# EAGLE design Review_PCD_1.8 (EAGLE 9.6.2)
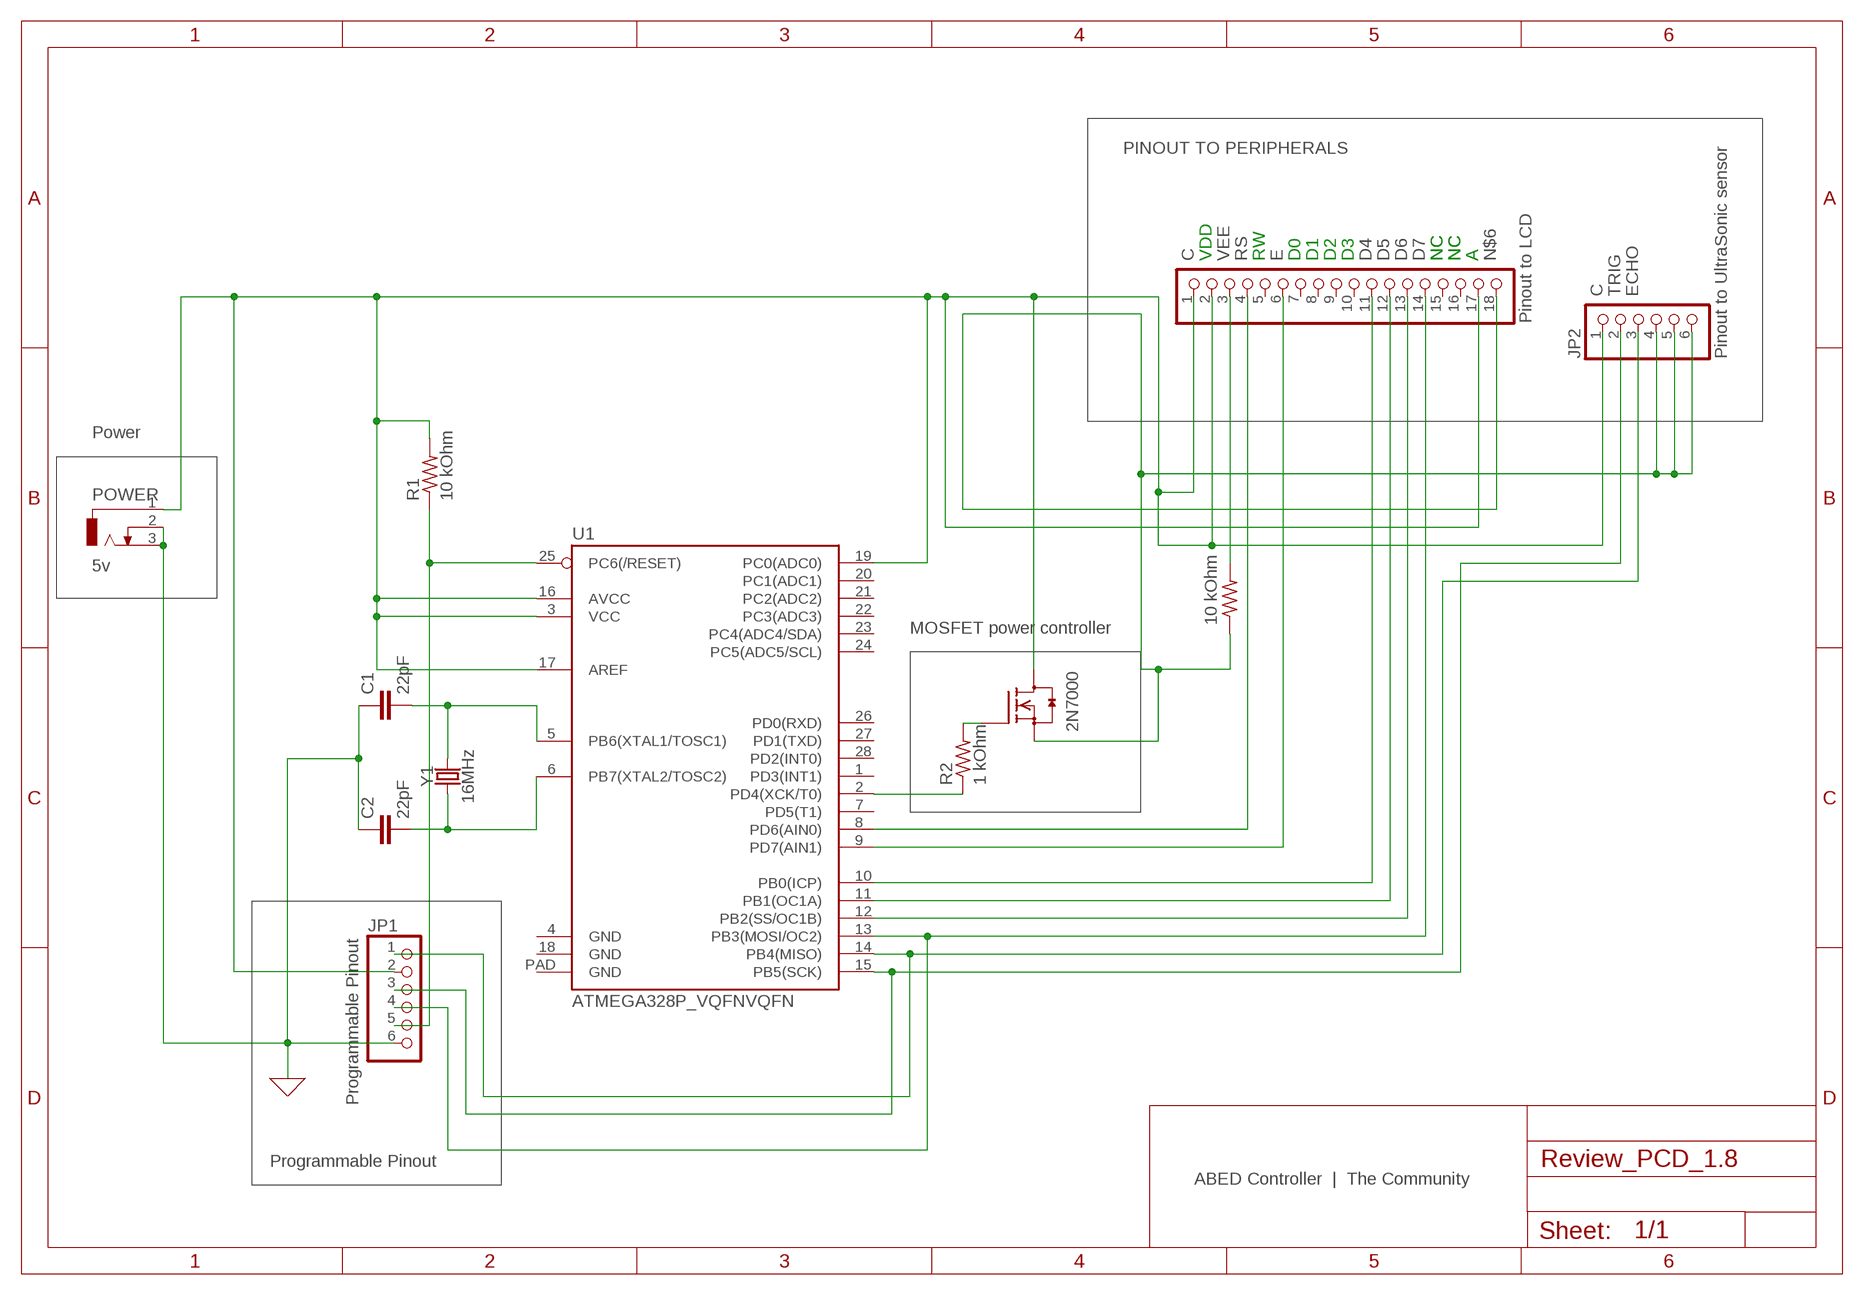
[diagram p0: schematic, sheet 1]

## Parts
C1  22pF  22PF-PTH-2.54MM-200V-5%  [CAP-PTH-2.54]
C2  22pF  22PF-PTH-2.54MM-200V-5%  [CAP-PTH-2.54]
JP1  Programmable Pinout  PINHD-1X6-3.5MM  [1X06-3.5MM]
JP2  Pinout to UltraSonic sensor  PINHD-1X6B  [1X06-BIG]
JP3  Pinout to LCD  PINHD-1X18  [1X18]
POWER  5v  DCJ0202  [DCJ0202]
Q2  2N7000  2N7000KL/BS170KL  [TO92]
R1  10 kOhm  R-US_R2012W  [R2012W]
R2  1 kOhm  R-US_R2012W  [R2012W]
R3  10 kOhm  R-US_R2012W  [R2012W]
U1  ATMEGA328P_VQFNVQFN  [VQFN-28]
Y1  16MHz  CRYSTAL-16MHZPTH-HC49US  [HC49US]

## Nets
0: C1.1 C2.1 JP1.6 POWER.2 POWER.3 ; supply symbol labelled GND
C: JP1.2 JP2.1 JP3.1 JP3.2 JP3.17 POWER.1 Q2.3(D) R1.2 U1.3(VCC) U1.16(AVCC) U1.17(AREF) U1.19(PC0(ADC0))
D4: JP3.11 U1.10(PB0(ICP))
D5: JP3.12 U1.11(PB1(OC1A))
D6: JP3.13 U1.12(PB2(SS/OC1B))
D7: JP1.4 JP3.14 U1.13(PB3(MOSI/OC2))
E: JP3.6 U1.9(PD7(AIN1))
ECHO: JP1.1 JP2.3 U1.14(PB4(MISO))
N$1: Q2.2(G) R2.2
N$2: JP1.5 R1.1 U1.25(PC6(/RESET))
N$3: R2.1 U1.2(PD4(XCK/T0))
N$4: C1.2 U1.5(PB6(XTAL1/TOSC1)) Y1.2
N$5: C2.2 U1.6(PB7(XTAL2/TOSC2)) Y1.1
N$6: JP2.4 JP2.5 JP2.6 JP3.18 Q2.1(S) R3.1
RS: JP3.4 U1.8(PD6(AIN0))
TRIG: JP1.3 JP2.2 U1.15(PB5(SCK))
VEE: JP3.3 R3.2
Unconnected: JP3.5 JP3.7 JP3.8 JP3.9 JP3.10 JP3.15 JP3.16 U1.1(PD3(INT1)) U1.4(GND) U1.7(PD5(T1)) U1.18(GND) U1.20(PC1(ADC1)) U1.21(PC2(ADC2)) U1.22(PC3(ADC3)) U1.23(PC4(ADC4/SDA)) U1.24(PC5(ADC5/SCL)) U1.26(PD0(RXD)) U1.27(PD1(TXD)) U1.28(PD2(INT0)) U1.PAD(GND)

## Notes on the sheet
- PINOUT TO PERIPHERALS
- VDD | RW | D0 | D1 | D2 | D3 | NC | NC | NC | NC | A
- Power
- MOSFET power controller
- Programmable Pinout
- ABED Controller  |  The Community

## Library data of the parts
C1 C2 = SparkFun-Capacitors:22PF: 22pF ceramic capacitors A capacitor is a passive two-terminal electrical component used to store electrical energy temporarily in an electric field.; PROD_ID: CAP-09128
JP1 JP2 = adafruit:PINHD-1X6: PIN HEADER
JP3 = adafruit:PINHD-1X18: PIN HEADER
POWER = con-jack:DCJ0202: DC POWER JACK Source: DCJ0202.pdf; OC_FARNELL: unknown; OC_NEWARK: unknown
Q2 = m-pad-2.1:2N7000KL/BS170KL: Vishay Siliconix 2N7000KL/BS170KL N-Channel 60-V (D-S) MOSFET FEATURES: TrenchFET Power MOSFET ESD Protected: 2000 V APPLICATIONS: Direct Logic-Level Interface: TTL/CMOS Soild State Relays Drivers: Relays, Solenoids, Lamps, Hammers, Displays, Memories, Transistors, etc. Battery Operated Systems Please send any comments to: messi@users.sourceforge.net
R1 = adafruit:R-US_: RESISTOR, American symbol
R2 = adafruit:R-US_: RESISTOR, American symbol; R1: 1 kOhm
R3 = adafruit:R-US_: RESISTOR, American symbol; R1: 10 kOhm
U1 = SparkFun-IC-Microcontroller:ATMEGA328P_VQFN: Atmel 328P QFN part not in catalog
Y1 = SparkFun-Clocks:CRYSTAL-16MHZ: 16MHz Crystal Digikey Example <http://www.digikey.com/product-search/en?keywords=535-9122-1-ND> Frequency: 16MHz Frequency Stability: ±50ppm Frequency Tolerance: ±20ppm Load Capacitance: 18pF SparkFun Products: Pro Micro -5V/16MHz <https://www.sparkfun.com/products/12640> SparkFun Serial Enabled LCD Kit <https://www.sparkfun.com/products/10097>; PROD_ID: XTAL-08181; SF_ID: COM-00536

## Board
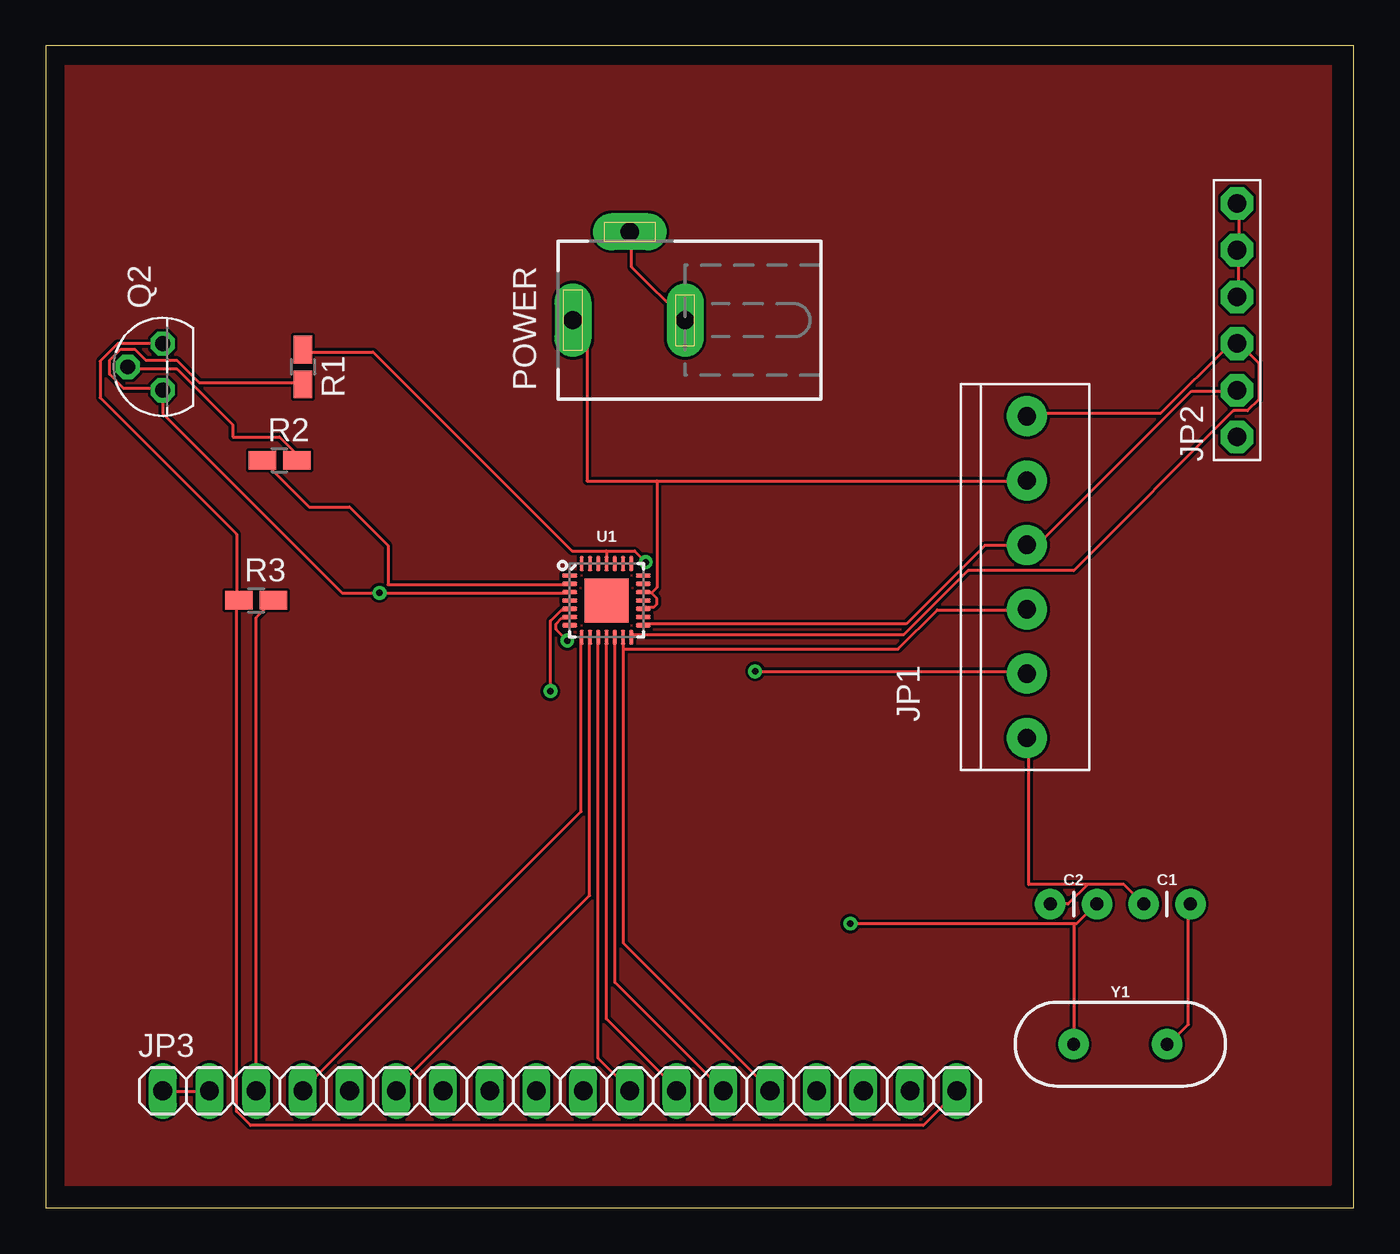
[diagram p1: board, top side]
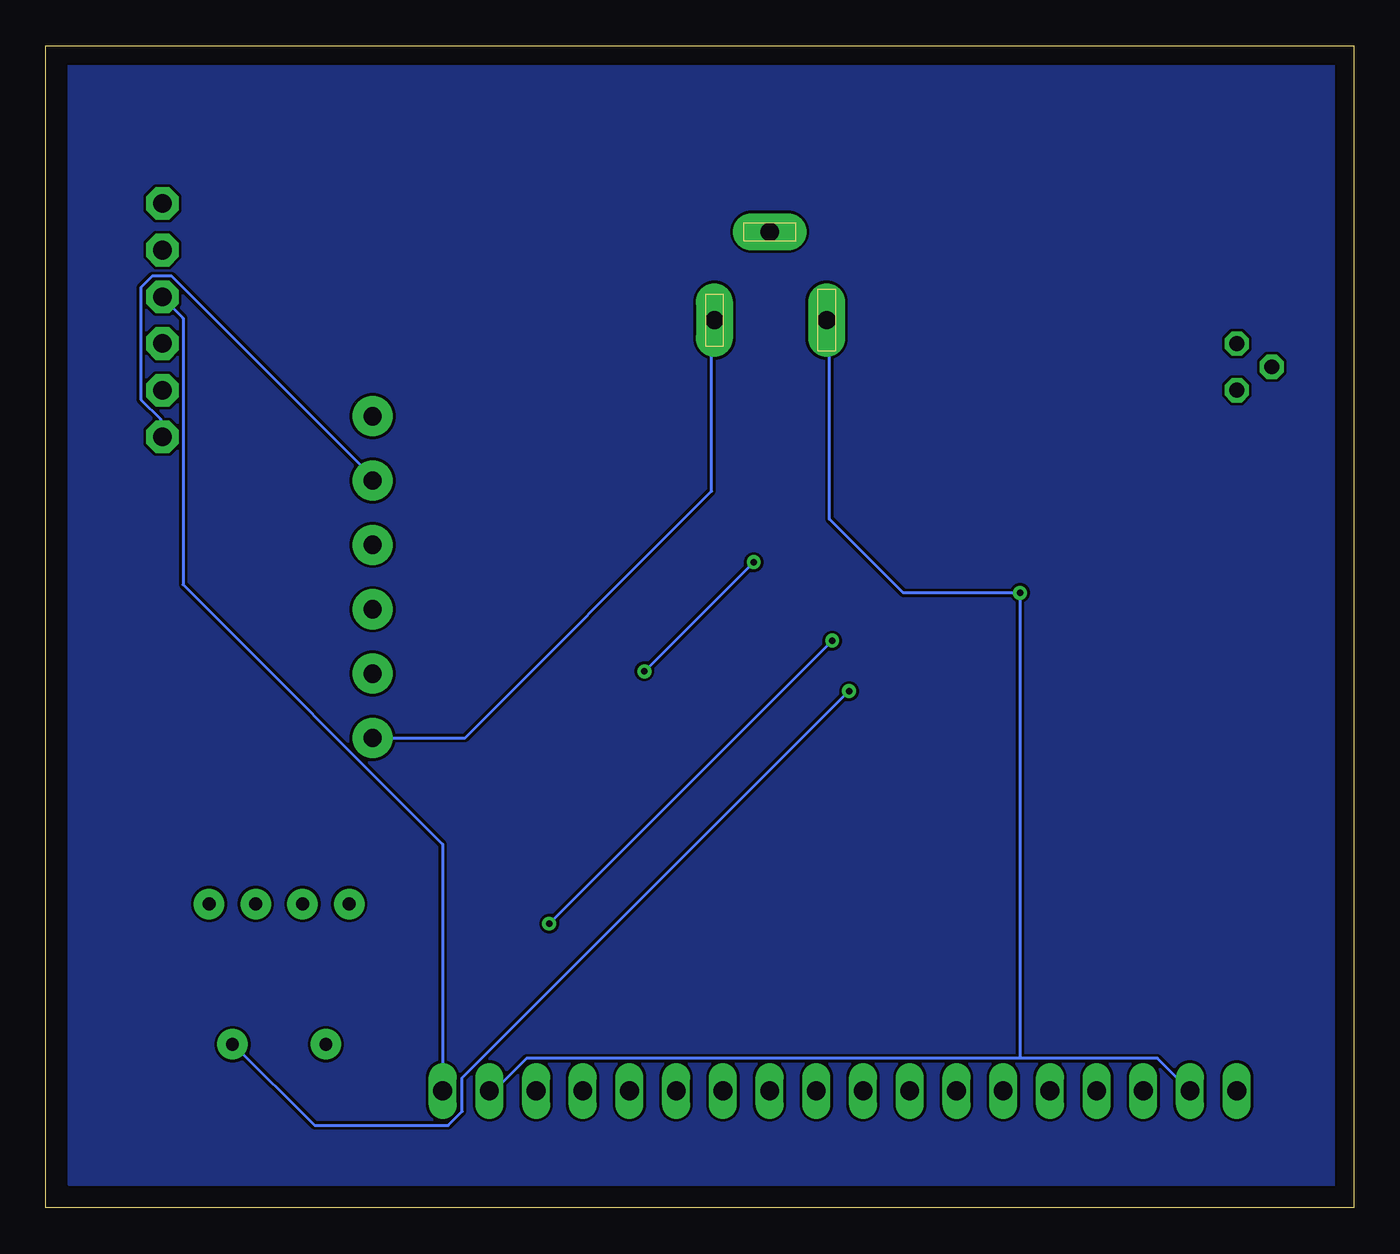
[diagram p2: board, bottom side, seen from below]

Size 71.1 x 63.17 mm. Coordinates in mm from the lower left corner, seen from the top.
Outline: 0,0 71.1,0 71.1,63.17 0,63.17 0,0
Copper layers (1*16): Top 0.035mm / dielectric 0.15mm / Bottom 0.035mm
Design rules "default": minimum track width 6mil, minimum drill 0.35mm, track to track 6mil, track to pad 6mil, pad to pad 6mil, via to via 6mil, smd to smd 6mil, copper to edge 40mil, drill to drill 6mil, minimum pad ring 10mil, minimum via ring 8mil, stop-mask expansion 4mil, vias tented up to drill 0mil, thermal gap 10mil

### Footprints (pad centres in the part's own frame; a part is rotated, then mirrored left to right if it is on the bottom)
CAP-PTH-2.54 = drill 0.7 pad 1.651: 1 -1.27,0; 2 1.27,0
1X06-3.5MM = drill 1 pad 2.184: 1 -8.75,0; 2 -5.25,0; 3 -1.75,0; 4 1.75,0; 5 5.25,0; 6 8.75,0
1X06-BIG = drill 1.016 pad 1.778 octagon: 1 -6.35,0; 2 -3.81,0; 3 -1.27,0; 4 1.27,0; 5 3.81,0; 6 6.35,0
1X18 = drill 1.016 long: 1 -21.59,0; 2 -19.05,0; 3 -16.51,0; 4 -13.97,0; 5 -11.43,0; 6 -8.89,0; 7 -6.35,0; 8 -3.81,0; 9 -1.27,0; 10 1.27,0; 11 3.81,0; 12 6.35,0; 13 8.89,0; 14 11.43,0; 15 13.97,0; 16 16.51,0; 17 19.05,0; 18 21.59,0
DCJ0202 = drill 1 pad 2 long: 1 0,3.1; 2 4.8,0; 3 0,-3
TO92 = drill 0.813 octagon: 1 1.27,0; 2 0,1.905; 3 -1.27,0
R2012W = smd 1.5 x 1: 1 -0.94,0; 2 0.94,0
VQFN-28 = smd 0.82 x 0.24: 1 -2,1.35; 2 -2,0.9; 3 -2,0.45; 4 -2,0; 5 -2,-0.45; 6 -2,-0.9; 7 -2,-1.35; 15 2,-1.35; 16 2,-0.9; 17 2,-0.45; 18 2,0; 19 2,0.45; 20 2,0.9; 21 2,1.35 | smd 0.24 x 0.82: 8 -1.35,-2; 9 -0.9,-2; 10 -0.45,-2; 11 0,-2; 12 0.45,-2; 13 0.9,-2; 14 1.35,-2; 22 1.35,2; 23 0.9,2; 24 0.45,2; 25 0,2; 26 -0.45,2; 27 -0.9,2; 28 -1.35,2 | smd 2.4 x 2.4: PAD 0,0
HC49US = drill 0.7 pad 1.651: 1 -2.54,0; 2 2.54,0

### Placement (x,y rotation side)
C1  60.96,16.51 0 top
C2  55.88,16.51 0 top
JP1  53.34,34.29 270 top
JP2  64.77,48.26 90 top
JP3  27.94,6.35 0 top
POWER  31.75,48.26 90 top
Q2  6.35,45.72 90 top
R1  13.97,45.72 270 top
R2  12.7,40.64 0 top
R3  11.43,33.02 0 top
U1  30.48,33.02 0 top
Y1  58.42,8.89 0 top

### Tracks (layer width: path | path; a pad name or v marks a point on that pad's centre or on a via)
0
  Top 0.152: POWER.2 31.85,52.98 31.85,51.16 POWER.3 | C2.1 55.57,16.51 56.64,17.58 | 56.64,17.58 58.62,17.58 C1.1 | 56.64,17.58 53.44,17.58 53.44,25.5 JP1.6
  Bottom 0.152: JP1.6 48.32,25.54 34.9,38.96 34.9,48.26 POWER.3
C  (via drill 0.35)
  Top 0.152: U1.16 32.46,32.21 32.46,32.51 U1.17 32.61,32.66 33.07,32.66 33.22,32.82 33.22,33.12 32.92,33.43 | 32.92,33.43 32.61,33.43 U1.19 | 32.92,33.43 33.22,33.73 33.22,39.52 | POWER.1 29.41,47.5 29.41,39.52 33.22,39.52 | 33.22,39.52 53.29,39.52 JP1.2 | JP3.1 6.4,6.3 8.84,6.3 JP3.2 | U1.3 28.35,33.43 v18.14,33.43 16.1,33.43 6.35,43.18 Q2.3 6.35,44.55 4.22,44.55 3.45,45.31 3.45,46.08 4.06,46.69 4.83,46.69 5.44,46.08 7.11,46.08 8.33,44.86 13.97,44.86 R1.2
  Bottom 0.152: JP2.1 64.87,41.96 64.87,42.88 65.94,43.94 65.94,50.04 65.33,50.65 64.26,50.65 53.29,39.68 JP1.2 | 18.14,8.13 10.67,8.13 JP3.2 | 18.14,8.13 44.96,8.13 46.63,6.45 46.94,6.45 JP3.17 | 18.14,8.13 v18.14,33.43 24.49,33.43 28.5,37.44 28.5,48.26 POWER.1
D4
  Top 0.152: U1.10 30.02,30.99 30.02,8.13 31.7,6.45 JP3.11
D5
  Top 0.152: U1.11 30.48,10.26 34.29,6.45 JP3.12
D6
  Top 0.152: JP3.13 30.94,12.24 30.94,30.99 U1.12
D7
  Top 0.152: 31.39,30.38 31.39,14.38 39.32,6.45 JP3.14 | 31.39,30.38 31.39,30.99 U1.13 | 31.39,30.38 46.33,30.38 48.46,32.51 53.29,32.51 JP1.4
E
  Top 0.152: U1.9 29.57,30.99 29.57,16.97 19.05,6.45 JP3.6
ECHO
  Top 0.152: U1.14 31.85,31.14 46.63,31.14 50.14,34.65 55.88,34.65 64.57,43.33 65.33,43.33 65.94,43.94 65.94,45.92 64.87,46.99 JP2.3 64.41,46.99 60.6,43.18 53.44,43.18 JP1.1
GND
  pour Bottom: 0,62.23 69.85,62.23 69.85,1.27 0,1.27
  pour Top: 0,62.23 0,1.27 69.85,1.27 69.85,62.23
N$1
  Top 0.152: Q2.2 4.52,45.62 7.11,45.62 10.16,42.57 10.16,41.91 12.7,41.91 13.64,40.97 R2.2
N$2  (via drill 0.35)
  Top 0.152: R1.1 13.97,46.53 17.78,46.53 28.6,35.71 30.48,35.71 | v38.56,29.16 53.29,29.16 JP1.5 | v32.61,35.1 32,35.71 30.48,35.71 | 30.48,35.71 U1.25
  Bottom 0.152: v32.61,35.1 v38.56,29.16
N$3
  Top 0.152: U1.2 28.35,33.88 18.59,33.88 18.59,36.02 16.51,38.1 14.3,38.1 R2.1
N$4  (via drill 0.35)
  Top 0.152: v27.43,28.09 27.43,31.9 28.04,32.51 28.35,32.51 U1.5 | C1.2 62.13,16.51 62.13,9.96 61.06,8.89 Y1.2
  Bottom 0.152: v27.43,28.09 48.46,7.06 48.46,5.23 49.23,4.47 56.49,4.47 60.91,8.89 Y1.2
N$5  (via drill 0.35)
  Top 0.152: v28.35,30.84 27.74,31.45 27.74,31.75 28.04,32.05 28.35,32.05 U1.6 | 55.88,15.44 56.03,15.44 57.1,16.51 C2.2 | 55.88,15.44 v43.74,15.44 | 55.88,15.44 Y1.1
  Bottom 0.152: v43.74,15.44 v28.35,30.84
N$6
  Top 0.152: Q2.1 3.91,46.99 2.95,46.02 2.95,44.04 10.36,36.63 10.36,33.15 | JP2.6 64.87,54.61 64.87,52.17 JP2.5 64.87,52.02 64.87,49.58 JP2.4 | 10.36,33.15 10.36,5.23 11.12,4.47 47.7,4.47 49.53,6.3 JP3.18 | R3.1 10.36,33.15
  Bottom 0.152: JP3.18 49.53,19.76 63.65,33.88 63.65,48.36 64.72,49.43 JP2.4
RS
  Top 0.152: U1.8 29.11,30.99 29.11,21.54 14.02,6.45 JP3.4
TRIG
  Top 0.152: U1.15 32.61,31.75 46.79,31.75 51.05,36.02 53.29,36.02 JP1.3 53.44,36.17 54.05,36.17 62.28,44.4 64.72,44.4 JP2.2
VEE
  Top 0.152: JP3.3 11.43,32.08 R3.2